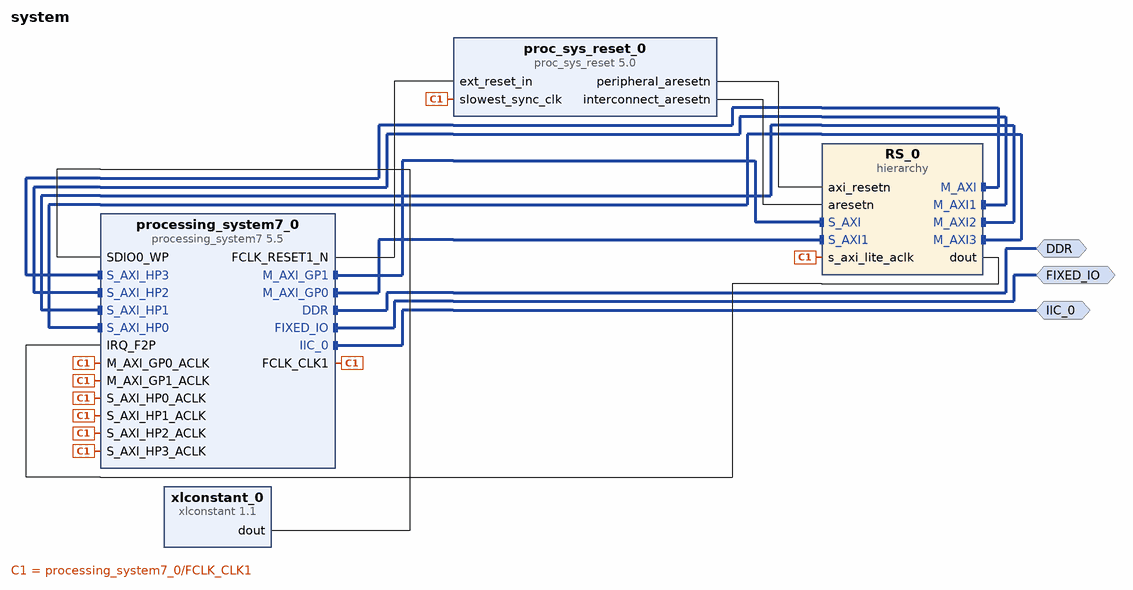
[diagram p0: block diagram of the top level]
# Vivado block design system, xc7z010clg400-1, Vivado 2016.3
create_bd_design system

create_bd_intf_port -mode Master -vlnv xilinx.com:interface:ddrx_rtl:1.0 DDR
create_bd_intf_port -mode Master -vlnv xilinx.com:display_processing_system7:fixedio_rtl:1.0 FIXED_IO
create_bd_intf_port -mode Master -vlnv xilinx.com:interface:iic_rtl:1.0 IIC_0

create_bd_cell -type ip -vlnv xilinx.com:ip:processing_system7:5.5 processing_system7_0
set_property -dict [list \
  CONFIG.PCW_FPGA1_PERIPHERAL_FREQMHZ 150 \
  CONFIG.PCW_FPGA2_PERIPHERAL_FREQMHZ 12.288 \
  CONFIG.PCW_USE_M_AXI_GP1 1 \
  CONFIG.PCW_USE_S_AXI_HP0 1 \
  CONFIG.PCW_USE_S_AXI_HP1 1 \
  CONFIG.PCW_USE_S_AXI_HP2 1 \
  CONFIG.PCW_USE_S_AXI_HP3 1 \
  CONFIG.PCW_USE_FABRIC_INTERRUPT 1 \
  CONFIG.PCW_S_AXI_HP0_DATA_WIDTH 32 \
  CONFIG.PCW_S_AXI_HP1_DATA_WIDTH 32 \
  CONFIG.PCW_S_AXI_HP2_DATA_WIDTH 32 \
  CONFIG.PCW_S_AXI_HP3_DATA_WIDTH 32 \
  CONFIG.PCW_EN_CLK0_PORT 0 \
  CONFIG.PCW_EN_CLK1_PORT 1 \
  CONFIG.PCW_EN_RST0_PORT 0 \
  CONFIG.PCW_EN_RST1_PORT 1 \
  CONFIG.PCW_IRQ_F2P_INTR 1 \
  CONFIG.PCW_IMPORT_BOARD_PRESET ./lib/xml/ZYBO_zynq_def.xml \
  CONFIG.PCW_SD0_PERIPHERAL_ENABLE 1 \
  CONFIG.PCW_SD0_GRP_CD_ENABLE 1 \
  CONFIG.PCW_SD0_GRP_CD_IO {MIO 47} \
  CONFIG.PCW_SD0_GRP_WP_ENABLE 1 \
  CONFIG.PCW_USB0_PERIPHERAL_ENABLE 1 \
  CONFIG.PCW_USB_RESET_ENABLE 0 \
  CONFIG.PCW_I2C0_PERIPHERAL_ENABLE 1 \
  CONFIG.PCW_I2C_RESET_ENABLE 0 \
  CONFIG.PCW_GPIO_MIO_GPIO_ENABLE 1 \
  CONFIG.PCW_FCLK1_PERIPHERAL_CLKSRC {DDR PLL} \
  CONFIG.PCW_FCLK2_PERIPHERAL_CLKSRC {ARM PLL} \
] [get_bd_cells processing_system7_0]
# 39 more settings of processing_system7_0 are not shown: defaults, MIO pin electricals, DDR timing, and values the tool derives
create_bd_cell -type hier RS_0
create_bd_cell -type ip -vlnv xilinx.com:ip:xlconstant:1.1 xlconstant_0
set_property -dict {CONFIG.CONST_VAL 0} [get_bd_cells xlconstant_0]
create_bd_cell -type ip -vlnv xilinx.com:ip:proc_sys_reset:5.0 proc_sys_reset_0

# ---- hierarchy /RS_0 ----
current_bd_instance /RS_0
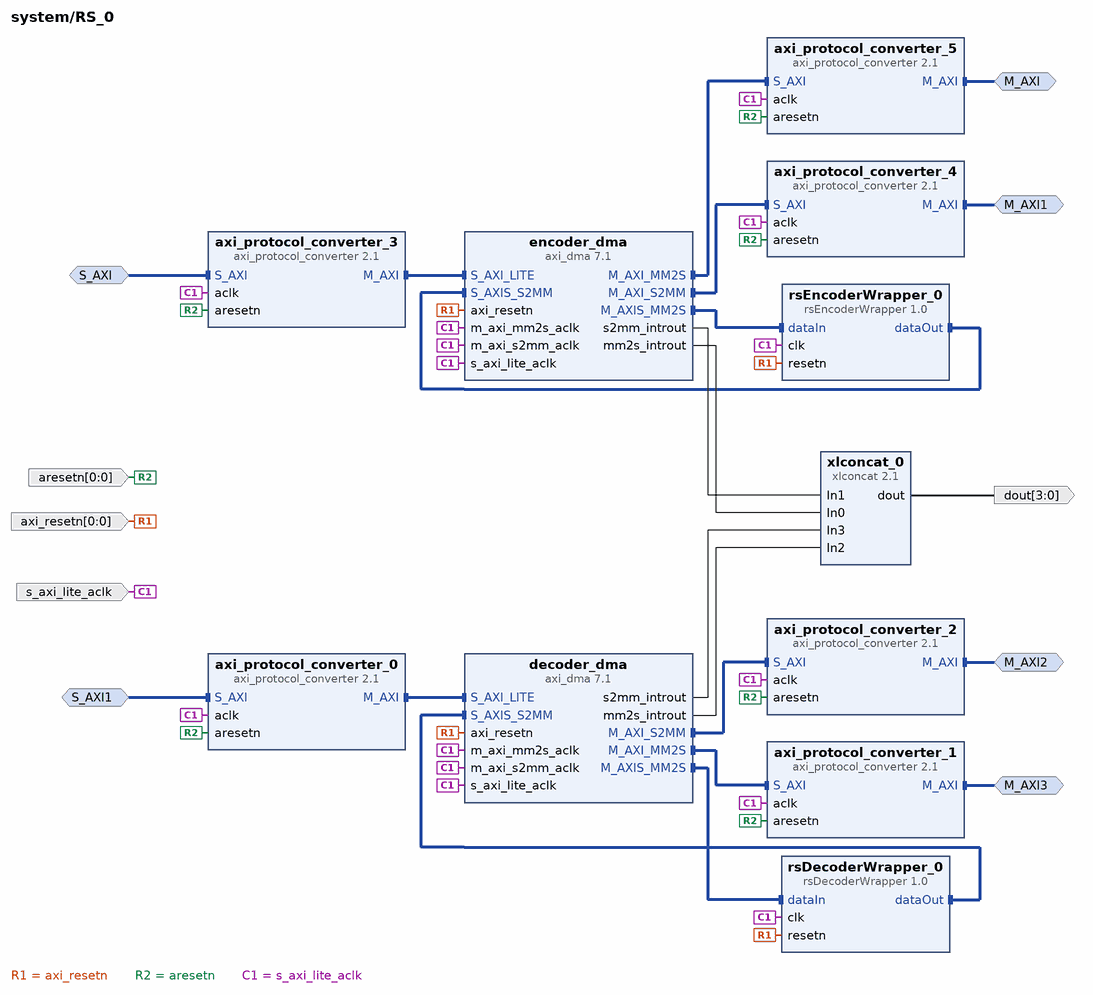
[diagram p1: block diagram inside /RS_0]
create_bd_intf_pin -mode Master -vlnv xilinx.com:interface:aximm_rtl:1.0 M_AXI
create_bd_intf_pin -mode Master -vlnv xilinx.com:interface:aximm_rtl:1.0 M_AXI1
create_bd_intf_pin -mode Master -vlnv xilinx.com:interface:aximm_rtl:1.0 M_AXI2
create_bd_intf_pin -mode Master -vlnv xilinx.com:interface:aximm_rtl:1.0 M_AXI3
create_bd_intf_pin -mode Slave -vlnv xilinx.com:interface:aximm_rtl:1.0 S_AXI
create_bd_intf_pin -mode Slave -vlnv xilinx.com:interface:aximm_rtl:1.0 S_AXI1
create_bd_pin -dir I -from 0 -to 0 -type rst axi_resetn
create_bd_pin -dir I -from 0 -to 0 -type rst aresetn
create_bd_pin -dir I -type clk s_axi_lite_aclk
create_bd_pin -dir O -from 3 -to 0 dout

create_bd_cell -type ip -vlnv dsumorok.com:user:rsEncoderWrapper:1.0 rsEncoderWrapper_0
create_bd_cell -type ip -vlnv dsumorok.com:user:rsDecoderWrapper:1.0 rsDecoderWrapper_0
create_bd_cell -type ip -vlnv xilinx.com:ip:xlconcat:2.1 xlconcat_0
set_property -dict {CONFIG.NUM_PORTS 4} [get_bd_cells xlconcat_0]
create_bd_cell -type ip -vlnv xilinx.com:ip:axi_dma:7.1 decoder_dma
set_property -dict [list \
  CONFIG.c_include_sg 0 \
  CONFIG.c_sg_length_width 20 \
  CONFIG.c_m_axis_mm2s_tdata_width 8 \
  CONFIG.c_mm2s_burst_size 16 \
] [get_bd_cells decoder_dma]
create_bd_cell -type ip -vlnv xilinx.com:ip:axi_dma:7.1 encoder_dma
set_property -dict [list \
  CONFIG.c_include_sg 0 \
  CONFIG.c_sg_length_width 20 \
  CONFIG.c_m_axis_mm2s_tdata_width 8 \
  CONFIG.c_mm2s_burst_size 16 \
] [get_bd_cells encoder_dma]
create_bd_cell -type ip -vlnv xilinx.com:ip:axi_protocol_converter:2.1 axi_protocol_converter_0
set_property -dict {CONFIG.MI_PROTOCOL AXI4LITE} [get_bd_cells axi_protocol_converter_0]
create_bd_cell -type ip -vlnv xilinx.com:ip:axi_protocol_converter:2.1 axi_protocol_converter_1
create_bd_cell -type ip -vlnv xilinx.com:ip:axi_protocol_converter:2.1 axi_protocol_converter_3
create_bd_cell -type ip -vlnv xilinx.com:ip:axi_protocol_converter:2.1 axi_protocol_converter_4
create_bd_cell -type ip -vlnv xilinx.com:ip:axi_protocol_converter:2.1 axi_protocol_converter_5
create_bd_cell -type ip -vlnv xilinx.com:ip:axi_protocol_converter:2.1 axi_protocol_converter_2

# ---- connections ----

current_bd_instance /RS_0
connect_bd_intf_net [get_bd_intf_pins axi_protocol_converter_0/M_AXI] [get_bd_intf_pins decoder_dma/S_AXI_LITE]
connect_bd_intf_net -intf_net axi_dma_0_M_AXI_S2MM [get_bd_intf_pins decoder_dma/M_AXI_S2MM] [get_bd_intf_pins axi_protocol_converter_2/S_AXI]
connect_bd_intf_net -intf_net axi_dma_0_M_AXI_MM2S [get_bd_intf_pins decoder_dma/M_AXI_MM2S] [get_bd_intf_pins axi_protocol_converter_1/S_AXI]
connect_bd_intf_net -intf_net axi_dma_0_M_AXIS_MM2S [get_bd_intf_pins decoder_dma/M_AXIS_MM2S] [get_bd_intf_pins rsDecoderWrapper_0/dataIn]
connect_bd_intf_net [get_bd_intf_pins rsDecoderWrapper_0/dataOut] [get_bd_intf_pins decoder_dma/S_AXIS_S2MM]
connect_bd_intf_net [get_bd_intf_pins axi_protocol_converter_3/M_AXI] [get_bd_intf_pins encoder_dma/S_AXI_LITE]
connect_bd_intf_net -intf_net axi_dma_1_M_AXIS_MM2S [get_bd_intf_pins encoder_dma/M_AXIS_MM2S] [get_bd_intf_pins rsEncoderWrapper_0/dataIn]
connect_bd_intf_net [get_bd_intf_pins rsEncoderWrapper_0/dataOut] [get_bd_intf_pins encoder_dma/S_AXIS_S2MM]
connect_bd_intf_net -intf_net axi_dma_1_M_AXI_MM2S [get_bd_intf_pins encoder_dma/M_AXI_MM2S] [get_bd_intf_pins axi_protocol_converter_5/S_AXI]
connect_bd_intf_net -intf_net axi_dma_1_M_AXI_S2MM [get_bd_intf_pins encoder_dma/M_AXI_S2MM] [get_bd_intf_pins axi_protocol_converter_4/S_AXI]
connect_bd_intf_net [get_bd_intf_pins M_AXI] [get_bd_intf_pins axi_protocol_converter_5/M_AXI]
connect_bd_intf_net [get_bd_intf_pins M_AXI1] [get_bd_intf_pins axi_protocol_converter_4/M_AXI]
connect_bd_intf_net [get_bd_intf_pins M_AXI2] [get_bd_intf_pins axi_protocol_converter_2/M_AXI]
connect_bd_intf_net [get_bd_intf_pins M_AXI3] [get_bd_intf_pins axi_protocol_converter_1/M_AXI]
connect_bd_intf_net [get_bd_intf_pins S_AXI] [get_bd_intf_pins axi_protocol_converter_3/S_AXI]
connect_bd_intf_net [get_bd_intf_pins S_AXI1] [get_bd_intf_pins axi_protocol_converter_0/S_AXI]
connect_bd_net [get_bd_pins axi_resetn] \
  [get_bd_pins rsEncoderWrapper_0/resetn] [get_bd_pins rsDecoderWrapper_0/resetn] [get_bd_pins decoder_dma/axi_resetn] \
  [get_bd_pins encoder_dma/axi_resetn]
connect_bd_net [get_bd_pins aresetn] \
  [get_bd_pins axi_protocol_converter_0/aresetn] [get_bd_pins axi_protocol_converter_1/aresetn] \
  [get_bd_pins axi_protocol_converter_3/aresetn] [get_bd_pins axi_protocol_converter_4/aresetn] \
  [get_bd_pins axi_protocol_converter_5/aresetn] [get_bd_pins axi_protocol_converter_2/aresetn]
connect_bd_net [get_bd_pins s_axi_lite_aclk] \
  [get_bd_pins rsEncoderWrapper_0/clk] [get_bd_pins rsDecoderWrapper_0/clk] [get_bd_pins decoder_dma/s_axi_lite_aclk] \
  [get_bd_pins decoder_dma/m_axi_mm2s_aclk] [get_bd_pins decoder_dma/m_axi_s2mm_aclk] \
  [get_bd_pins encoder_dma/s_axi_lite_aclk] [get_bd_pins encoder_dma/m_axi_mm2s_aclk] \
  [get_bd_pins encoder_dma/m_axi_s2mm_aclk] [get_bd_pins axi_protocol_converter_0/aclk] \
  [get_bd_pins axi_protocol_converter_1/aclk] [get_bd_pins axi_protocol_converter_3/aclk] \
  [get_bd_pins axi_protocol_converter_4/aclk] [get_bd_pins axi_protocol_converter_5/aclk] \
  [get_bd_pins axi_protocol_converter_2/aclk]
connect_bd_net -net axi_dma_1_s2mm_introut [get_bd_pins encoder_dma/s2mm_introut] [get_bd_pins xlconcat_0/In1]
connect_bd_net -net axi_dma_1_mm2s_introut [get_bd_pins encoder_dma/mm2s_introut] [get_bd_pins xlconcat_0/In0]
connect_bd_net -net axi_dma_0_s2mm_introut [get_bd_pins decoder_dma/s2mm_introut] [get_bd_pins xlconcat_0/In3]
connect_bd_net -net axi_dma_0_mm2s_introut [get_bd_pins decoder_dma/mm2s_introut] [get_bd_pins xlconcat_0/In2]
connect_bd_net [get_bd_pins xlconcat_0/dout] [get_bd_pins dout]

current_bd_instance /
connect_bd_intf_net [get_bd_intf_pins processing_system7_0/S_AXI_HP3] [get_bd_intf_pins RS_0/M_AXI]
connect_bd_intf_net [get_bd_intf_pins processing_system7_0/S_AXI_HP2] [get_bd_intf_pins RS_0/M_AXI1]
connect_bd_intf_net [get_bd_intf_pins processing_system7_0/S_AXI_HP1] [get_bd_intf_pins RS_0/M_AXI2]
connect_bd_intf_net [get_bd_intf_pins processing_system7_0/S_AXI_HP0] [get_bd_intf_pins RS_0/M_AXI3]
connect_bd_intf_net [get_bd_intf_pins processing_system7_0/M_AXI_GP1] [get_bd_intf_pins RS_0/S_AXI]
connect_bd_intf_net [get_bd_intf_pins processing_system7_0/M_AXI_GP0] [get_bd_intf_pins RS_0/S_AXI1]
connect_bd_intf_net [get_bd_intf_ports DDR] [get_bd_intf_pins processing_system7_0/DDR]
connect_bd_intf_net [get_bd_intf_ports FIXED_IO] [get_bd_intf_pins processing_system7_0/FIXED_IO]
connect_bd_intf_net [get_bd_intf_ports IIC_0] [get_bd_intf_pins processing_system7_0/IIC_0]
connect_bd_net [get_bd_pins processing_system7_0/FCLK_CLK1] \
  [get_bd_pins processing_system7_0/M_AXI_GP0_ACLK] [get_bd_pins processing_system7_0/M_AXI_GP1_ACLK] \
  [get_bd_pins processing_system7_0/S_AXI_HP0_ACLK] [get_bd_pins processing_system7_0/S_AXI_HP1_ACLK] \
  [get_bd_pins processing_system7_0/S_AXI_HP2_ACLK] [get_bd_pins processing_system7_0/S_AXI_HP3_ACLK] \
  [get_bd_pins proc_sys_reset_0/slowest_sync_clk] [get_bd_pins RS_0/s_axi_lite_aclk]
connect_bd_net [get_bd_pins processing_system7_0/FCLK_RESET1_N] [get_bd_pins proc_sys_reset_0/ext_reset_in]
connect_bd_net [get_bd_pins proc_sys_reset_0/peripheral_aresetn] [get_bd_pins RS_0/axi_resetn]
connect_bd_net [get_bd_pins proc_sys_reset_0/interconnect_aresetn] [get_bd_pins RS_0/aresetn]
connect_bd_net [get_bd_pins RS_0/dout] [get_bd_pins processing_system7_0/IRQ_F2P]
connect_bd_net [get_bd_pins xlconstant_0/dout] [get_bd_pins processing_system7_0/SDIO0_WP]

# ---- address map ----
assign_bd_address -offset 0x40400000 -range 64K -target_address_space [get_bd_addr_spaces processing_system7_0/Data] [get_bd_addr_segs RS_0/decoder_dma/S_AXI_LITE/Reg]
assign_bd_address -offset 0x80400000 -range 64K -target_address_space [get_bd_addr_spaces processing_system7_0/Data] [get_bd_addr_segs RS_0/encoder_dma/S_AXI_LITE/Reg]
assign_bd_address -offset 0x00000000 -range 512M -target_address_space [get_bd_addr_spaces RS_0/decoder_dma/Data_MM2S] [get_bd_addr_segs processing_system7_0/S_AXI_HP0/HP0_DDR_LOWOCM]
assign_bd_address -offset 0x00000000 -range 512M -target_address_space [get_bd_addr_spaces RS_0/decoder_dma/Data_S2MM] [get_bd_addr_segs processing_system7_0/S_AXI_HP1/HP1_DDR_LOWOCM]
assign_bd_address -offset 0x00000000 -range 512M -target_address_space [get_bd_addr_spaces RS_0/encoder_dma/Data_MM2S] [get_bd_addr_segs processing_system7_0/S_AXI_HP3/HP3_DDR_LOWOCM]
assign_bd_address -offset 0x00000000 -range 512M -target_address_space [get_bd_addr_spaces RS_0/encoder_dma/Data_S2MM] [get_bd_addr_segs processing_system7_0/S_AXI_HP2/HP2_DDR_LOWOCM]

validate_bd_design
save_bd_design
